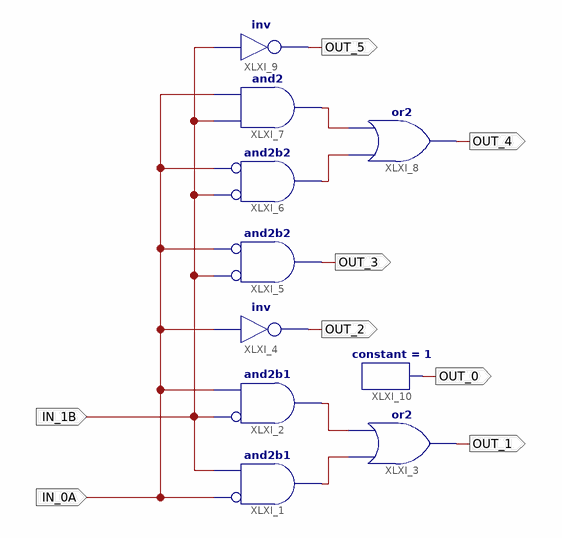
[diagram p0: schematic sheet 1]
// Xilinx ISE schematic My2To6Decoder.sch (spartan3a) as structural Verilog: 10 symbols, 8 ports
module My2To6Decoder (
  input  IN_0A,
  input  IN_1B,
  output OUT_1,
  output OUT_2,
  output OUT_3,
  output OUT_4,
  output OUT_5,
  output OUT_0
);

  wire XLXN_4, XLXN_5, XLXN_6, XLXN_7;

  and XLXI_1 (XLXN_7, ~IN_0A, IN_1B);  // and2b1
  and XLXI_2 (XLXN_6, ~IN_1B, IN_0A);  // and2b1
  or XLXI_3 (OUT_1, XLXN_7, XLXN_6);
  and XLXI_6 (XLXN_5, ~IN_1B, ~IN_0A);  // and2b2
  and XLXI_7 (XLXN_4, IN_1B, IN_0A);
  or XLXI_8 (OUT_4, XLXN_5, XLXN_4);
  not XLXI_9 (OUT_5, IN_1B);
  not XLXI_4 (OUT_2, IN_0A);
  and XLXI_5 (OUT_3, ~IN_1B, ~IN_0A);  // and2b2
  constant #(.CValue("1")) XLXI_10 (.O(OUT_0));
endmodule
